# Altium project STM32_Digital_Audio.PrjPcb
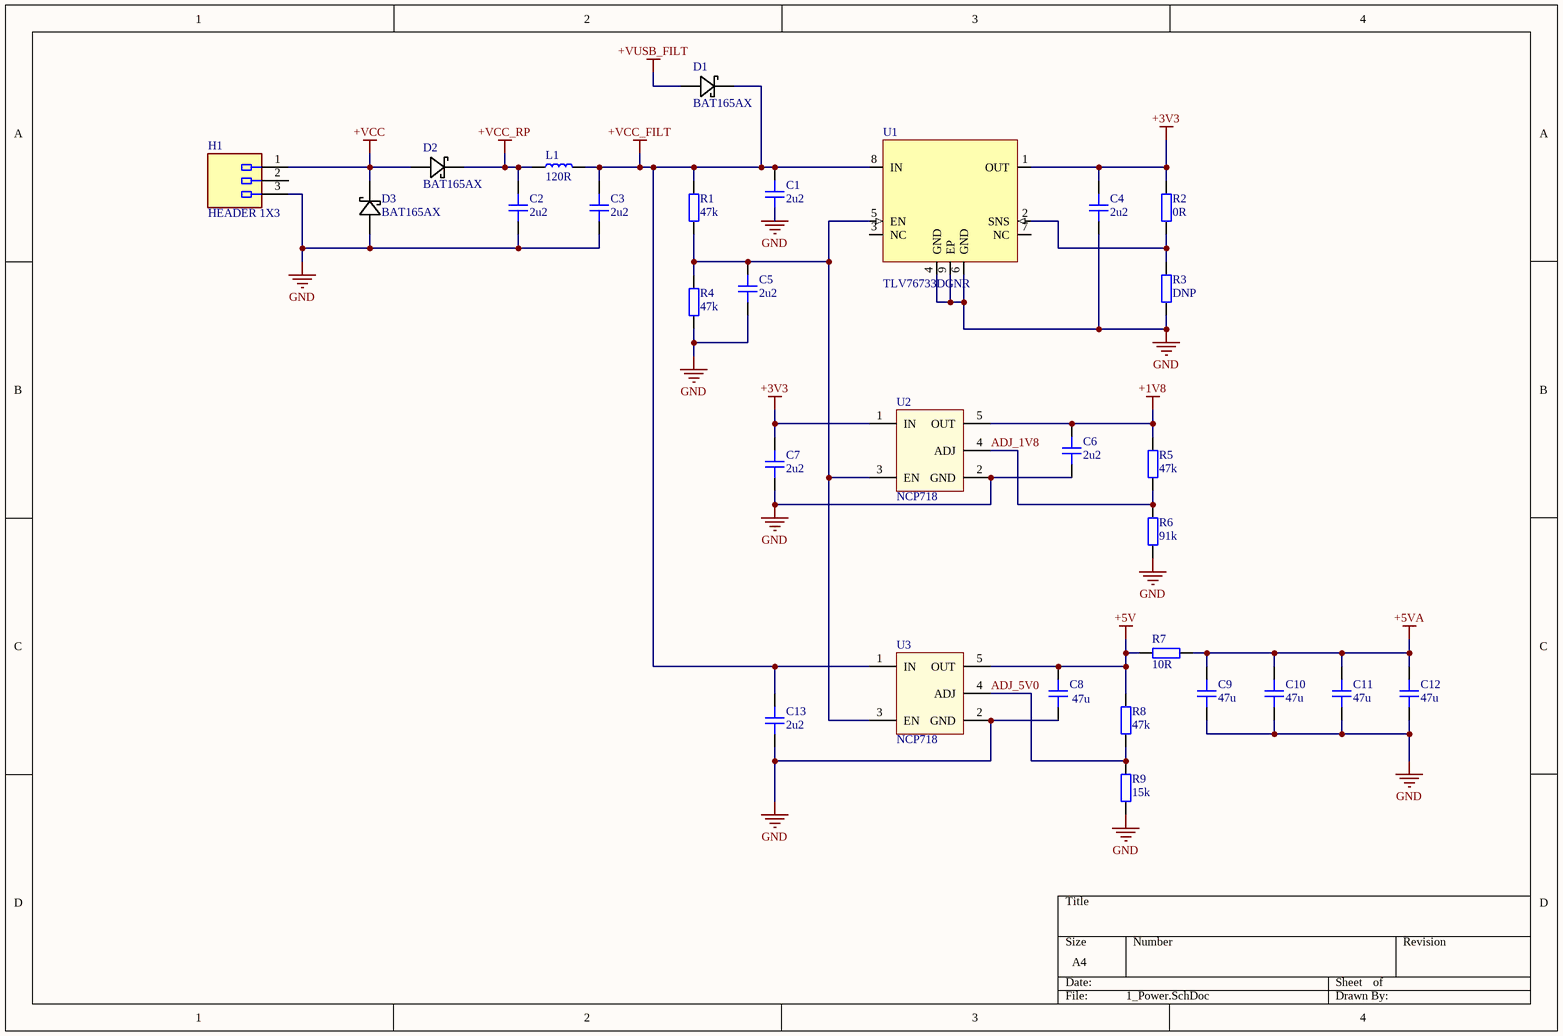
[diagram p0: 1_Power.SchDoc]
7 sheets, 218 parts. Net scope: global (net labels, ports and power ports of the same name join across sheets).
Board file: PCB.PcbDoc
Sheets:
  1_Power.SchDoc
  2_MCU.SchDoc
  3_Memory.SchDoc
  4_USB-HS.SchDoc
  5_Periperals.SchDoc
  6_CODEC.SchDoc
  7_Analogue.SchDoc

## Sheet 1_Power.SchDoc
size A4; SheetNumber: 1; SheetTotal: 7

### Parts
C1  2u2  [CAP_0201]
C2  2u2  [CAP_0201]
C3  2u2  [CAP_0201]
C4  2u2  [CAP_0201]
C5  2u2  [CAP_0201]
C6  2u2  [CAP_0201]
C7  2u2  [CAP_0201]
C8  47u  [CAP_0201]
C9  47u  [CAP_0201]
C10  47u  [CAP_0201]
C11  47u  [CAP_0201]
C12  47u  [CAP_0201]
C13  2u2  [CAP_0201]
D1  BAT165AX  [BAT165AX]
D2  BAT165AX  [BAT165AX]
D3  BAT165AX  [BAT165AX]
H1  HEADER 1X3  [053048-0310]
L1  120R  [IND_1008]
R1  47k  [RES_0402]
R2  0R  [RES_0805]
R3  DNP  [RES_0805]
R4  47k  [RES_0402]
R5  47k  [RES_0402]
R6  91k  [RES_0402]
R7  10R  [RES_0402]
R8  47k  [RES_0402]
R9  15k  [RES_0402]
U1  TLV76733DGNR  [HVSSOP-8]
U2  NCP718  [NCP718]
U3  NCP718  [NCP718]

### Nets
+1V8: C6.2 R5.2 U2.5(OUT)
+3V3: C4.2 C7.2 R2.2 U1.1(OUT) U2.1(IN)
+5V: C8.2 R7.2 R8.2 U3.5(OUT)
+5VA: C9.2 C10.2 C11.2 C12.2 R7.1
+VCC: D2.2 D3.1 H1.1
+VCC_FILT: C1.2 C3.2 C13.2 D1.1 L1.2 R1.2 U1.8(IN) U3.1(IN)
+VCC_RP: C2.2 D2.1 L1.1
+VUSB_FILT: D1.2
GND: C1.1 C2.1 C3.1 C4.1 C5.1 C6.1 C7.1 C8.1 C9.1 C10.1 C11.1 C12.1 C13.1 D3.2 H1.3 R3.1 R4.1 R6.1 R9.1 U1.4(GND) U1.6(GND) U1.9(EP) U2.2(GND) U3.2(GND)
ADJ_1V8: R5.1 R6.2 U2.4(ADJ)
ADJ_5V0: R8.1 R9.2 U3.4(ADJ)
NetC5_2: C5.2 R1.1 R4.2 U1.5(EN) U2.3(EN) U3.3(EN)
NetR2_1: R2.1 R3.2 U1.2(SNS)

Not connected (* = marked no-connect by the designer): H1 2; U1 3(NC) 7(NC)

### Library data of the parts
C1-C13 = CAP_0201: Capacitor SMD 0201; Manufacturer: *; Manufacturer Part Number: *; Distributor Link: *; LCSC: *; Rating: *; Dielectric: *
H1 = 053048-0310
L1 = IND_1008: Inductor SMD 1008
R1 R4-R9 = RES_0402: Resistor SMD 0402; Manufacturer: *; Manufacturer Part Number: *; Distributor Link: *; LCSC: *
R2 R3 = RES_0805: Resistor SMD 0805; Manufacturer: *; Manufacturer Part Number: *; Distributor Link: *; LCSC: *
U1 = TLV76733DGNR: 1A 3V3 LDO Regulator HVSSOP-8; Manufacturer: Texas Instruments; Manufacturer Part Number: TLV76733DGNR; Distributor Link: https://www.mouser.de/ProductDetail/Texas-Instruments/TLV76733DGNR?qs=sGAEpiMZZMug9GoBKXZ751mAF56Mq1BpE6IEorDiG8zdSVWisnEjQA%3D%3D

## Sheet 2_MCU.SchDoc
size 420 x 297 mm; SheetNumber: 2; SheetTotal: 7
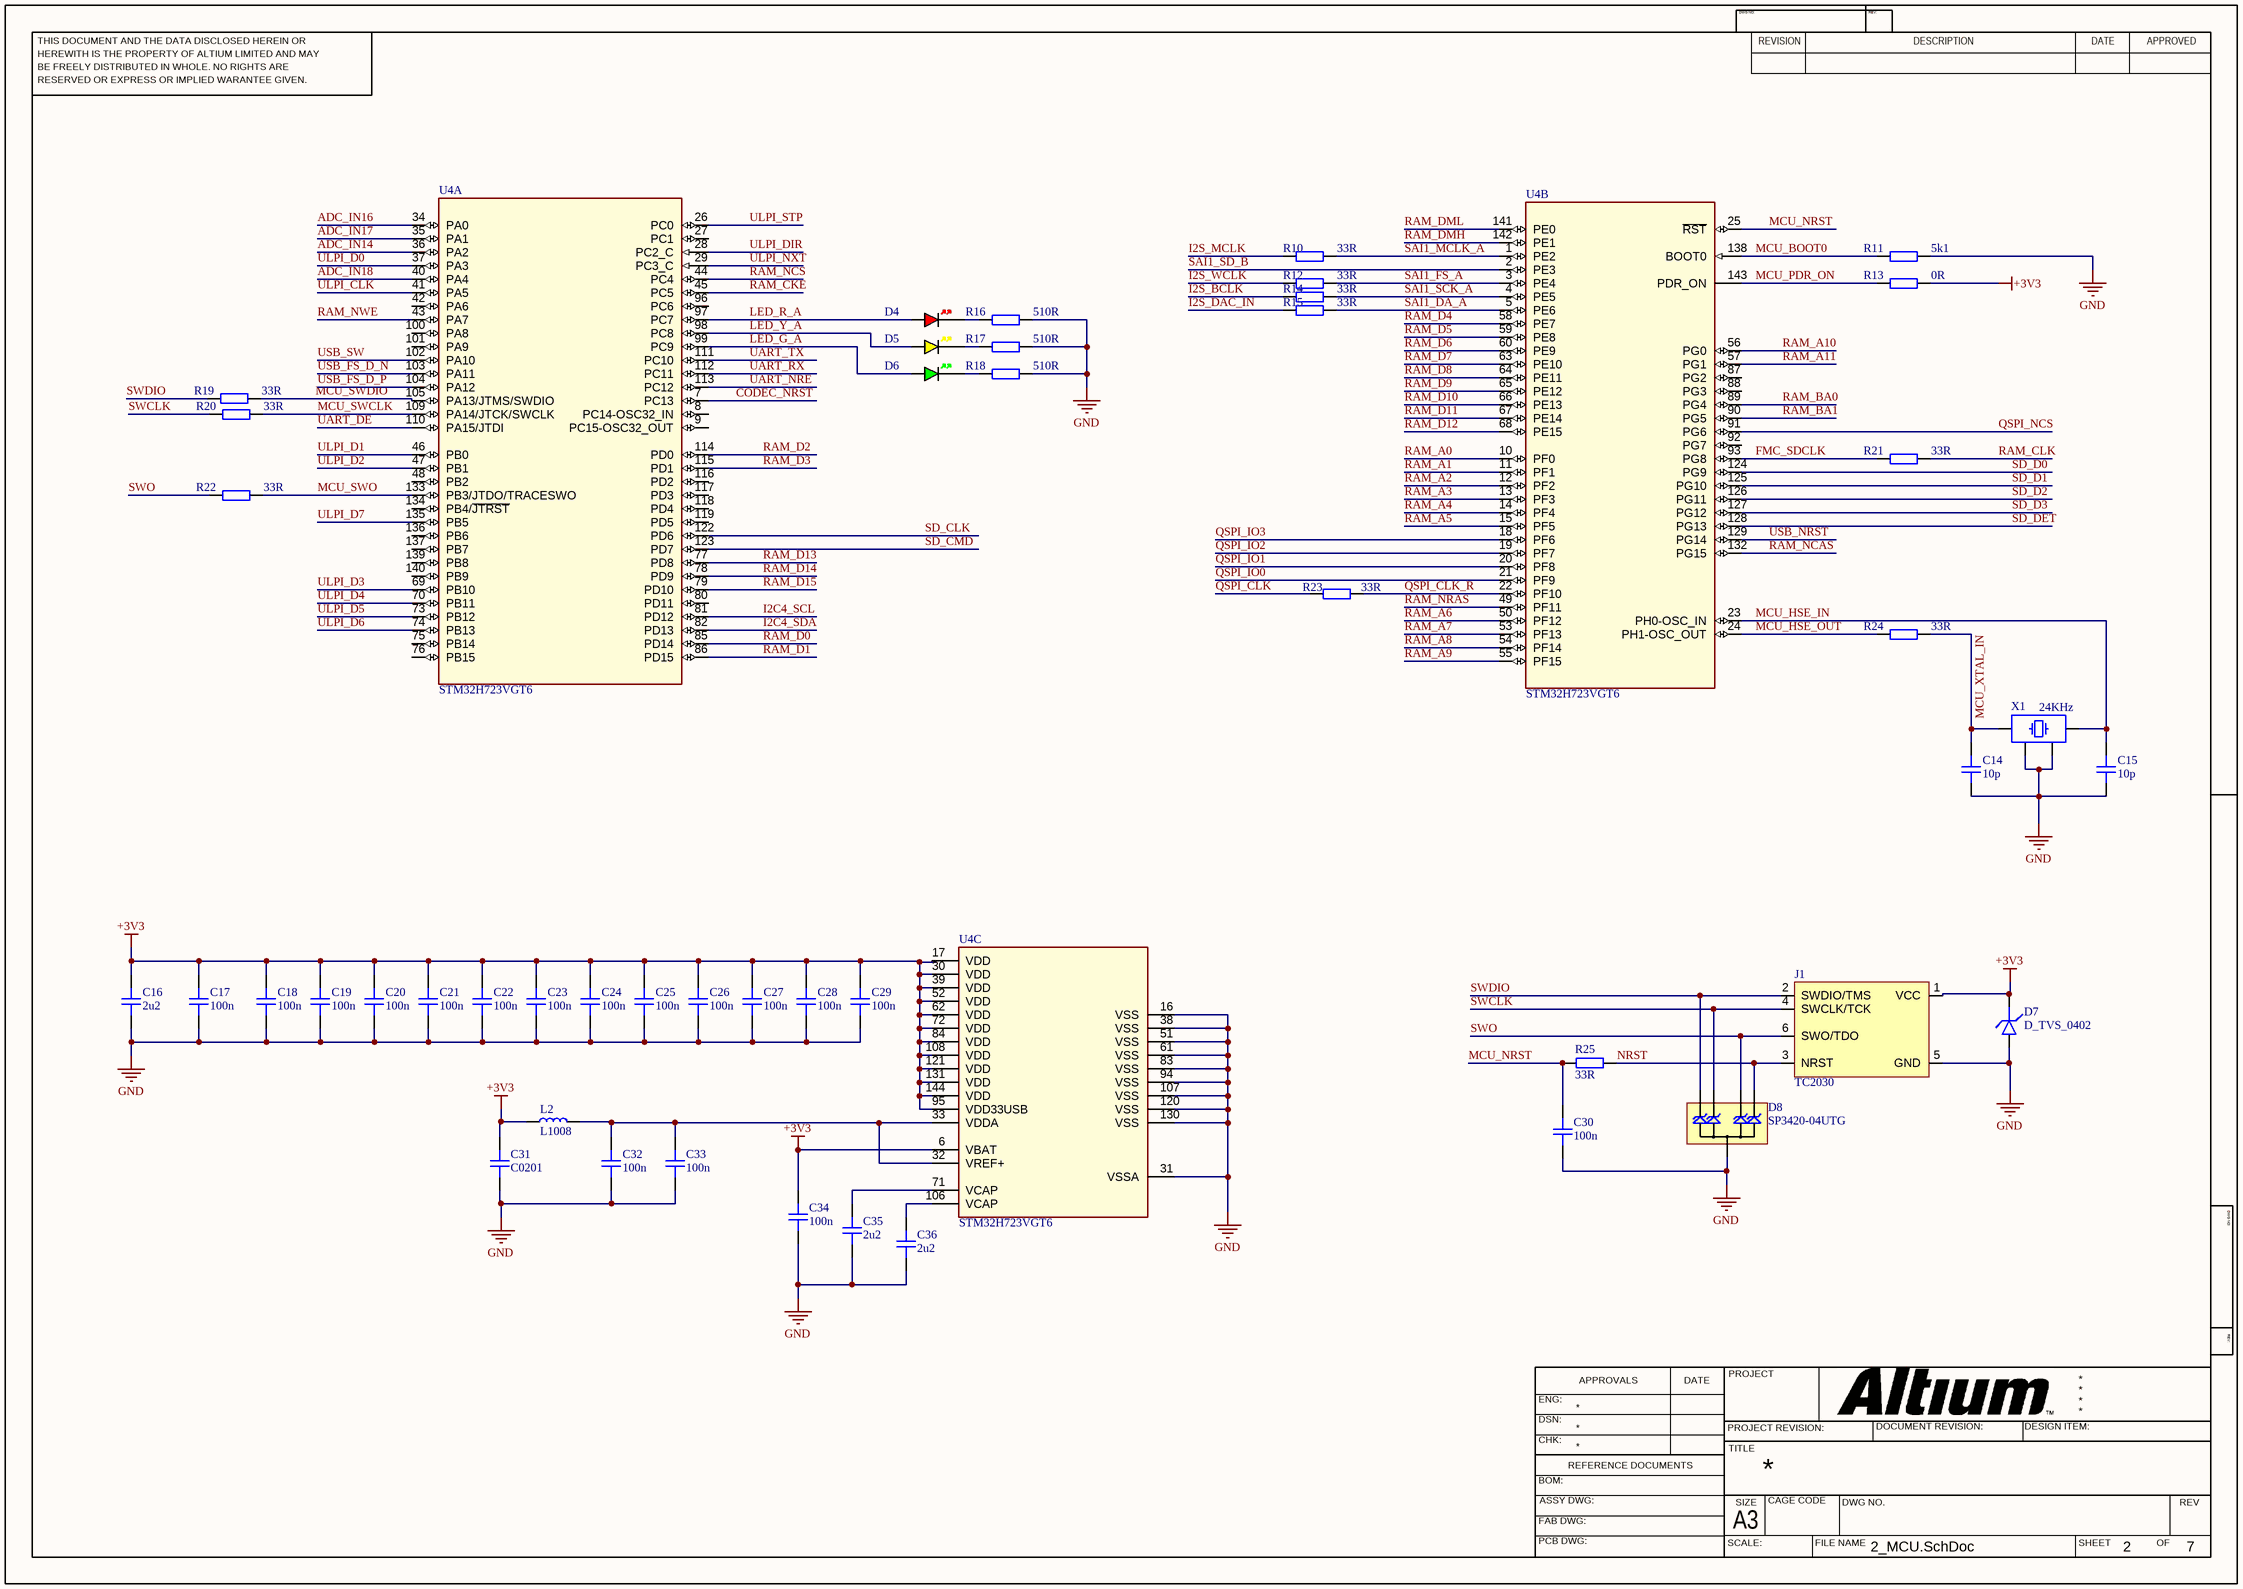
[diagram p1: 2_MCU.SchDoc]

### Parts
C14  10p  [CAP_0201]
C15  10p  [CAP_0201]
C16  2u2  [CAP_0201]
C17  100n  [CAP_0201]
C18  100n  [CAP_0201]
C19  100n  [CAP_0201]
C20  100n  [CAP_0201]
C21  100n  [CAP_0201]
C22  100n  [CAP_0201]
C23  100n  [CAP_0201]
C24  100n  [CAP_0201]
C25  100n  [CAP_0201]
C26  100n  [CAP_0201]
C27  100n  [CAP_0201]
C28  100n  [CAP_0201]
C29  100n  [CAP_0201]
C30  100n  [CAP_0201]
C31  C0201  [CAP_0201]
C32  100n  [CAP_0201]
C33  100n  [CAP_0201]
C34  100n  [CAP_0201]
C35  2u2  [CAP_0201]
C36  2u2  [CAP_0201]
D4  RED  [LED_0603_RED]  (value not drawn)
D5  YELLOW  [LED_0603_YELLOW]  (value not drawn)
D6  GREEN  [LED_0603_GREEN]  (value not drawn)
D7  D_TVS_0402  [D_0402]
D8  SP3420-04UTG  [uDFN-10]
J1  TC2030  [TC2030-FP]  (no BOM)
L2  L1008  [IND_1008]
R10  33R  [RES_0402]
R11  5k1  [RES_0402]
R12  33R  [RES_0402]
R13  0R  [RES_0402]
R14  33R  [RES_0402]
R15  33R  [RES_0402]
R16  510R  [RES_0402]
R17  510R  [RES_0402]
R18  510R  [RES_0402]
R19  33R  [RES_0402]
R20  33R  [RES_0402]
R21  33R  [RES_0402]
R22  33R  [RES_0402]
R23  33R  [RES_0402]
R24  33R  [RES_0402]
R25  33R  [RES_0402]
U4  STM32H723VGT6  [STM32H7]  (parts A,B,C of 3)
X1  24KHz  [XTAL_2520]

### Nets
+3V3: C16.2 C17.2 C18.2 C19.2 C20.2 C21.2 C22.2 C23.2 C24.2 C25.2 C26.2 C27.2 C28.2 C29.2 C31.2 C34.2 D7.K J1.1(VCC) L2.1 R13.2 U4.6(VBAT) U4.30(VDD) U4.39(VDD) U4.52(VDD) U4.62(VDD) U4.72(VDD) U4.84(VDD) U4.95(VDD33USB) U4.108(VDD) U4.121(VDD) U4.131(VDD) U4.144(VDD)
GND: C14.1 C15.1 C16.1 C17.1 C18.1 C19.1 C20.1 C21.1 C22.1 C23.1 C24.1 C25.1 C26.1 C27.1 C28.1 C29.1 C30.1 C31.1 C32.1 C33.1 C34.1 C35.1 C36.1 D7.A D8.38(GND) J1.5(GND) R11.2 R16.2 R17.2 R18.2 U4.16(VSS) U4.31(VSSA) U4.38(VSS) U4.51(VSS) U4.61(VSS) U4.83(VSS) U4.94(VSS) U4.107(VSS) U4.120(VSS) U4.130(VSS) X1.2 X1.4
ADC_IN14: U4.36(PA2)
ADC_IN16: U4.34(PA0)
ADC_IN17: U4.35(PA1)
ADC_IN18: U4.40(PA4)
CODEC_NRST: U4.7(PC13)
FMC_SDCLK: R21.1 U4.93(PG8)
I2C4_SCL: U4.81(PD12)
I2C4_SDA: U4.82(PD13)
I2S_BCLK: R14.1
I2S_DAC_IN: R15.1
I2S_MCLK: R10.1
I2S_WCLK: R12.1
LED_G_A: D6.A U4.99(PC9)
LED_R_A: D4.A U4.97(PC7)
LED_Y_A: D5.A U4.98(PC8)
MCU_BOOT0: R11.1 U4.138(BOOT0)
MCU_HSE_IN: C15.2 U4.23(PH0-OSC_IN) X1.3
MCU_HSE_OUT: R24.1 U4.24(PH1-OSC_OUT)
MCU_NRST: C30.2 R25.1 U4.25(~{RST})
MCU_PDR_ON: R13.1 U4.143(PDR_ON)
MCU_SWCLK: R20.2 U4.109(PA14/JTCK/SWCLK)
MCU_SWDIO: R19.2 U4.105(PA13/JTMS/SWDIO)
MCU_SWO: R22.2 U4.133(PB3/JTDO/TRACESWO)
MCU_XTAL_IN: C14.2 R24.2 X1.1
NRST: D8.56 J1.3(NRST) R25.2
QSPI_CLK: R23.1
QSPI_CLK_R: R23.2 U4.22(PF10)
QSPI_IO0: U4.21(PF9)
QSPI_IO1: U4.20(PF8)
QSPI_IO2: U4.19(PF7)
QSPI_IO3: U4.18(PF6)
QSPI_NCS: U4.91(PG6)
RAM_A0: U4.10(PF0)
RAM_A1: U4.11(PF1)
RAM_A2: U4.12(PF2)
RAM_A3: U4.13(PF3)
RAM_A4: U4.14(PF4)
RAM_A5: U4.15(PF5)
RAM_A6: U4.50(PF12)
RAM_A7: U4.53(PF13)
RAM_A8: U4.54(PF14)
RAM_A9: U4.55(PF15)
RAM_A10: U4.56(PG0)
RAM_A11: U4.57(PG1)
RAM_BA0: U4.89(PG4)
RAM_BA1: U4.90(PG5)
RAM_CKE: U4.45(PC5)
RAM_CLK: R21.2
RAM_D0: U4.85(PD14)
RAM_D1: U4.86(PD15)
RAM_D2: U4.114(PD0)
RAM_D3: U4.115(PD1)
RAM_D4: U4.58(PE7)
RAM_D5: U4.59(PE8)
RAM_D6: U4.60(PE9)
RAM_D7: U4.63(PE10)
RAM_D8: U4.64(PE11)
RAM_D9: U4.65(PE12)
RAM_D10: U4.66(PE13)
RAM_D11: U4.67(PE14)
RAM_D12: U4.68(PE15)
RAM_D13: U4.77(PD8)
RAM_D14: U4.78(PD9)
RAM_D15: U4.79(PD10)
RAM_DMH: U4.142(PE1)
RAM_DML: U4.141(PE0)
RAM_NCAS: U4.132(PG15)
RAM_NCS: U4.44(PC4)
RAM_NRAS: U4.49(PF11)
RAM_NWE: U4.43(PA7)
SAI1_DA_A: R15.2 U4.5(PE6)
SAI1_FS_A: R12.2 U4.3(PE4)
SAI1_MCLK_A: R10.2 U4.1(PE2)
SAI1_SCK_A: R14.2 U4.4(PE5)
SAI1_SD_B: U4.2(PE3)
SD_CLK: U4.122(PD6)
SD_CMD: U4.123(PD7)
SD_D0: U4.124(PG9)
SD_D1: U4.125(PG10)
SD_D2: U4.126(PG11)
SD_D3: U4.127(PG12)
SD_DET: U4.128(PG13)
SWCLK: D8.29 J1.4(SWCLK/TCK) R20.1
SWDIO: D8.110 J1.2(SWDIO/TMS) R19.1
SWO: D8.47 J1.6(SWO/TDO) R22.1
UART_DE: U4.110(PA15/JTDI)
UART_NRE: U4.113(PC12)
UART_RX: U4.112(PC11)
UART_TX: U4.111(PC10)
ULPI_CLK: U4.41(PA5)
ULPI_D0: U4.37(PA3)
ULPI_D1: U4.46(PB0)
ULPI_D2: U4.47(PB1)
ULPI_D3: U4.69(PB10)
ULPI_D4: U4.70(PB11)
ULPI_D5: U4.73(PB12)
ULPI_D6: U4.74(PB13)
ULPI_D7: U4.135(PB5)
ULPI_DIR: U4.28(PC2_C)
ULPI_NXT: U4.29(PC3_C)
ULPI_STP: U4.26(PC0)
USB_FS_D_N: U4.103(PA11)
USB_FS_D_P: U4.104(PA12)
USB_NRST: U4.129(PG14)
USB_SW: U4.102(PA10)
NetC32_2: C32.2 C33.2 L2.2 U4.32(VREF+) U4.33(VDDA)
NetC35_2: C35.2 U4.71(VCAP)
NetC36_2: C36.2 U4.106(VCAP)
NetD4_K: D4.K R16.1
NetD5_K: D5.K R17.1
NetD6_K: D6.K R18.1

Not connected (* = marked no-connect by the designer): U4 8(PC14-OSC32_IN) 9(PC15-OSC32_OUT) 17(VDD) 27(PC1) 42(PA6) 48(PB2) 75(PB14) 76(PB15) 80(PD11) 87(PG2) 88(PG3) 92(PG7) 96(PC6) 100(PA8) 101(PA9) 116(PD2) 117(PD3) 118(PD4) 119(PD5) 134(PB4/~{JTRST}) 136(PB6) 137(PB7) 139(PB8) 140(PB9)

### Notes on the sheet
- THIS DOCUMENT AND THE DATA DISCLOSED HEREIN OR
- HEREWITH IS THE PROPERTY OF ALTIUM LIMITED AND MAY
- DWG NO:
- REVISION
- REV:
- DESCRIPTION
- DATE
- APPROVED
- BE FREELY DISTRIBUTED IN WHOLE. NO RIGHTS ARE
- RESERVED OR EXPRESS OR IMPLIED WARANTEE GIVEN.
- ENG:
- APPROVALS
- PROJECT
- DSN:
- CHK:
- REFERENCE DOCUMENTS
- PROJECT REVISION:
- TITLE
- DOCUMENT REVISION:
- DESIGN ITEM:
- BOM:
- FAB DWG:
- PCB DWG:
- ASSY DWG:
- SCALE:
- A3
- SIZE
- CAGE CODE
- FILE NAME
- DWG NO.
- SHEET
- OF
- REV

### Library data of the parts
C14-C36 = CAP_0201: Capacitor SMD 0201; Manufacturer: *; Manufacturer Part Number: *; Distributor Link: *; LCSC: *; Rating: *; Dielectric: *
D4 = LED_0603_RED: LED 0603 RED SMD
D5 = LED_0603_YELLOW: LED 0603 YELLOW SMD
D6 = LED_0603_GREEN: LED 0603 GREEN SMD
D7 = D_TVS_0402: Diode TVS / ESD 0402
D8 = SP3420-04UTG: TVS Diode Array Low Capacitance ESD Protection 4-Channel (Vwork=3V3, Vclamp=6V); Manufacturer: Littelfuse; Manufacturer Part Number: SP3420-04UTG
J1 = TC2030: Tag-Connect No-Solder SWD Debug Connector DO NOT PLACE; Manufacturer: Tag-Connect; Manufacturer Part Number: TC2030
L2 = IND_1008: Inductor SMD 1008
R10-R25 = RES_0402: Resistor SMD 0402; Manufacturer: *; Manufacturer Part Number: *; Distributor Link: *; LCSC: *
X1 = XTAL_2520: Crystal SMD 2520; Distributor Link: *

## Sheet 3_Memory.SchDoc
size A4; SheetNumber: 3; SheetTotal: 7
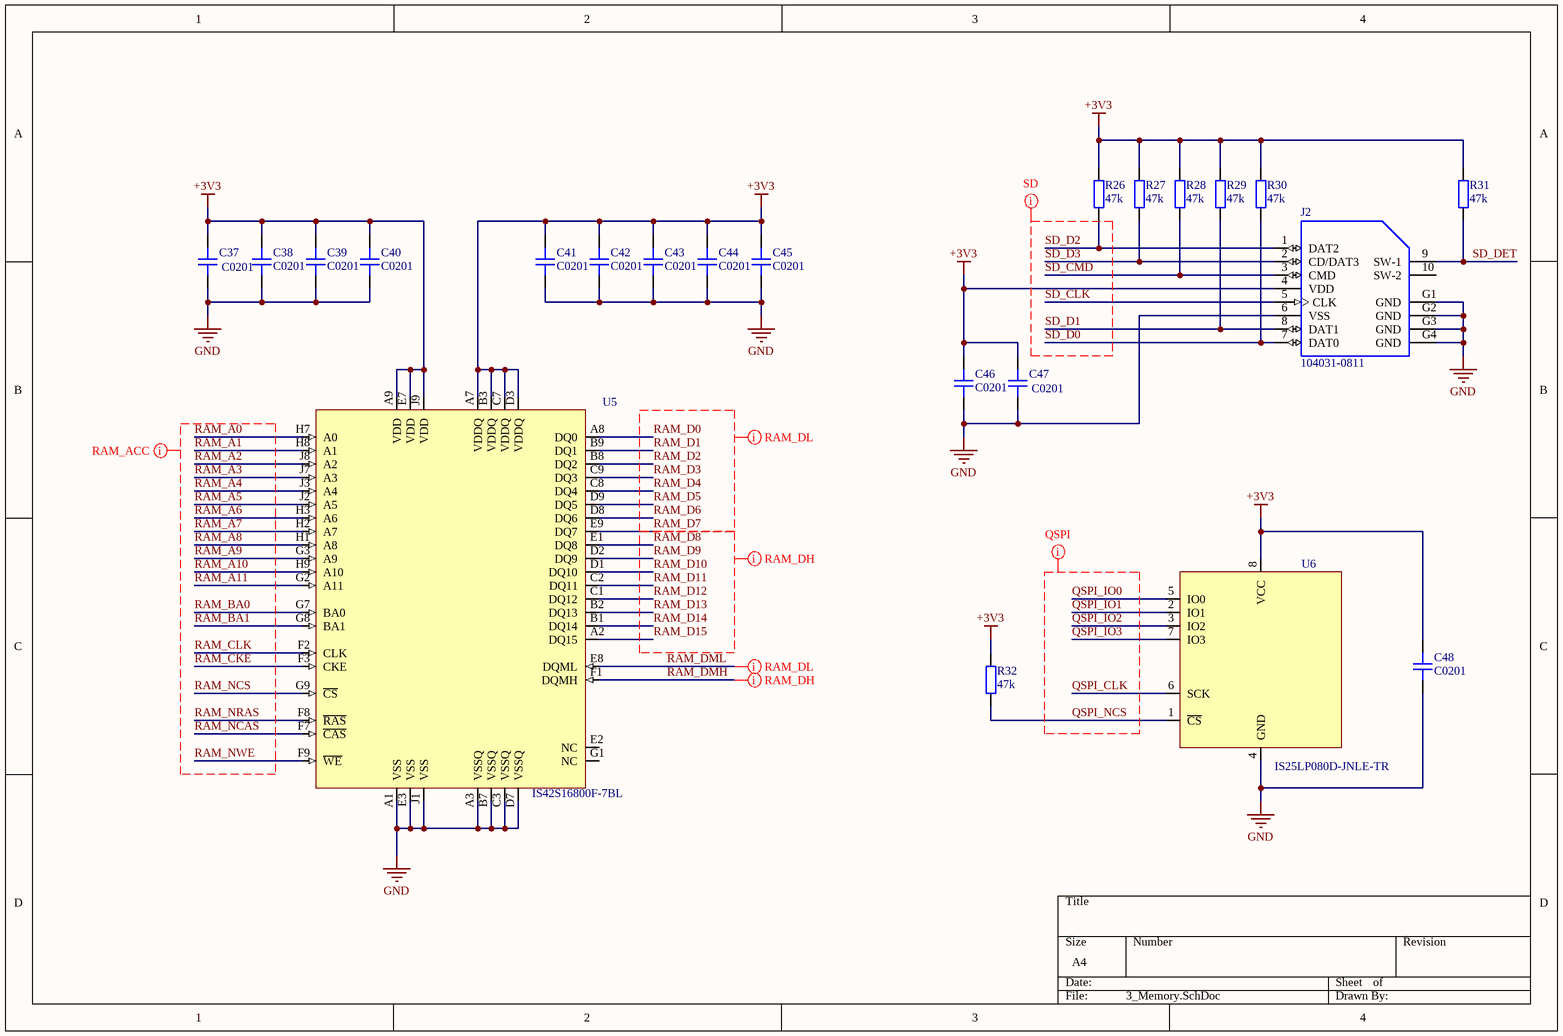
[diagram p2: 3_Memory.SchDoc]

### Parts
C37  C0201  [CAP_0201]
C38  C0201  [CAP_0201]
C39  C0201  [CAP_0201]
C40  C0201  [CAP_0201]
C41  C0201  [CAP_0201]
C42  C0201  [CAP_0201]
C43  C0201  [CAP_0201]
C44  C0201  [CAP_0201]
C45  C0201  [CAP_0201]
C46  C0201  [CAP_0201]
C47  C0201  [CAP_0201]
C48  C0201  [CAP_0201]
J2  104031-0811  [104031-0811]
R26  47k  [RES_0402]
R27  47k  [RES_0402]
R28  47k  [RES_0402]
R29  47k  [RES_0402]
R30  47k  [RES_0402]
R31  47k  [RES_0402]
R32  47k  [RES_0402]
U5  IS42S16800F-7BL  [BGA54C80P9X9_800X800X120]
U6  IS25LP080D-JNLE-TR  [SOIC-8]

### Nets
+3V3: C37.2 C38.2 C39.2 C40.2 C41.2 C42.2 C43.2 C44.2 C45.2 C46.2 C47.2 C48.2 J2.4(VDD) R26.2 R27.2 R28.2 R29.2 R30.2 R31.2 R32.2 U5.A7(VDDQ) U5.A9(VDD) U5.B3(VDDQ) U5.C7(VDDQ) U5.D3(VDDQ) U5.E7(VDD) U5.J9(VDD) U6.8(VCC)
GND: C37.1 C38.1 C39.1 C40.1 C41.1 C42.1 C43.1 C44.1 C45.1 C46.1 C47.1 C48.1 J2.6(VSS) J2.G1(GND) J2.G2(GND) J2.G3(GND) J2.G4(GND) U5.A1(VSS) U5.A3(VSSQ) U5.B7(VSSQ) U5.C3(VSSQ) U5.D7(VSSQ) U5.E3(VSS) U5.J1(VSS) U6.4(GND)
QSPI_CLK: U6.6(SCK)
QSPI_IO0: U6.5(IO0)
QSPI_IO1: U6.2(IO1)
QSPI_IO2: U6.3(IO2)
QSPI_IO3: U6.7(IO3)
QSPI_NCS: R32.1 U6.1(~{CS})
RAM_A0: U5.H7(A0)
RAM_A1: U5.H8(A1)
RAM_A2: U5.J8(A2)
RAM_A3: U5.J7(A3)
RAM_A4: U5.J3(A4)
RAM_A5: U5.J2(A5)
RAM_A6: U5.H3(A6)
RAM_A7: U5.H2(A7)
RAM_A8: U5.H1(A8)
RAM_A9: U5.G3(A9)
RAM_A10: U5.H9(A10)
RAM_A11: U5.G2(A11)
RAM_BA0: U5.G7(BA0)
RAM_BA1: U5.G8(BA1)
RAM_CKE: U5.F3(CKE)
RAM_CLK: U5.F2(CLK)
RAM_D0: U5.A8(DQ0)
RAM_D1: U5.B9(DQ1)
RAM_D2: U5.B8(DQ2)
RAM_D3: U5.C9(DQ3)
RAM_D4: U5.C8(DQ4)
RAM_D5: U5.D9(DQ5)
RAM_D6: U5.D8(DQ6)
RAM_D7: U5.E9(DQ7)
RAM_D8: U5.E1(DQ8)
RAM_D9: U5.D2(DQ9)
RAM_D10: U5.D1(DQ10)
RAM_D11: U5.C2(DQ11)
RAM_D12: U5.C1(DQ12)
RAM_D13: U5.B2(DQ13)
RAM_D14: U5.B1(DQ14)
RAM_D15: U5.A2(DQ15)
RAM_DMH: U5.F1(DQMH)
RAM_DML: U5.E8(DQML)
RAM_NCAS: U5.F7(~{CAS})
RAM_NCS: U5.G9(~{CS})
RAM_NRAS: U5.F8(~{RAS})
RAM_NWE: U5.F9(~{WE})
SD_CLK: J2.5(CLK)
SD_CMD: J2.3(CMD) R28.1
SD_D0: J2.7(DAT0) R30.1
SD_D1: J2.8(DAT1) R29.1
SD_D2: J2.1(DAT2) R26.1
SD_D3: J2.2(CD/DAT3) R27.1
SD_DET: J2.9(SW-1) R31.1

Not connected (* = marked no-connect by the designer): J2 10(SW-2); U5 E2(NC) G1(NC)

### Layout directives
net class RAM_DL: RAM_D0, RAM_D1, RAM_D2, RAM_D3, RAM_D4, RAM_D5, RAM_D6, RAM_D7, RAM_DML
net class RAM_DH: RAM_D7, RAM_D8, RAM_D9, RAM_D10, RAM_D11, RAM_D12, RAM_D13, RAM_D14, RAM_D15, RAM_DMH
net class RAM_ACC: RAM_A0, RAM_A1, RAM_A2, RAM_A3, RAM_A4, RAM_A5, RAM_A6, RAM_A7, RAM_A8, RAM_A9, RAM_A10, RAM_A11, RAM_BA0, RAM_BA1, RAM_CKE, RAM_CLK, RAM_NCAS, RAM_NCS, RAM_NRAS, RAM_NWE
net class QSPI: QSPI_CLK, QSPI_IO0, QSPI_IO1, QSPI_IO2, QSPI_IO3, QSPI_NCS
net class SD: SD_CLK, SD_CMD, SD_D0, SD_D1, SD_D2, SD_D3

### Library data of the parts
C37-C48 = CAP_0201: Capacitor SMD 0201; Manufacturer: *; Manufacturer Part Number: *; Distributor Link: *; LCSC: *; Rating: *; Dielectric: *
R26-R32 = RES_0402: Resistor SMD 0402; Manufacturer: *; Manufacturer Part Number: *; Distributor Link: *; LCSC: *
U5 = IS42S16800F-*B: SDRAM 128Mbit 8Mx16 143Mhz 3.3V 54-ball BGA; Manufacturer: ISSI; Manufacturer Part Number: IS42S16800F-*B*
U6 = IS25LP080D-JNLE-TR: QSPI NOR Flash Memory 8 Mbit SOIC-8; Manufacturer: ISSI; Manufacturer Part Number: IS25LP080D-JNLE-TR

## Sheet 4_USB-HS.SchDoc
size A4; SheetNumber: 4; SheetTotal: 7
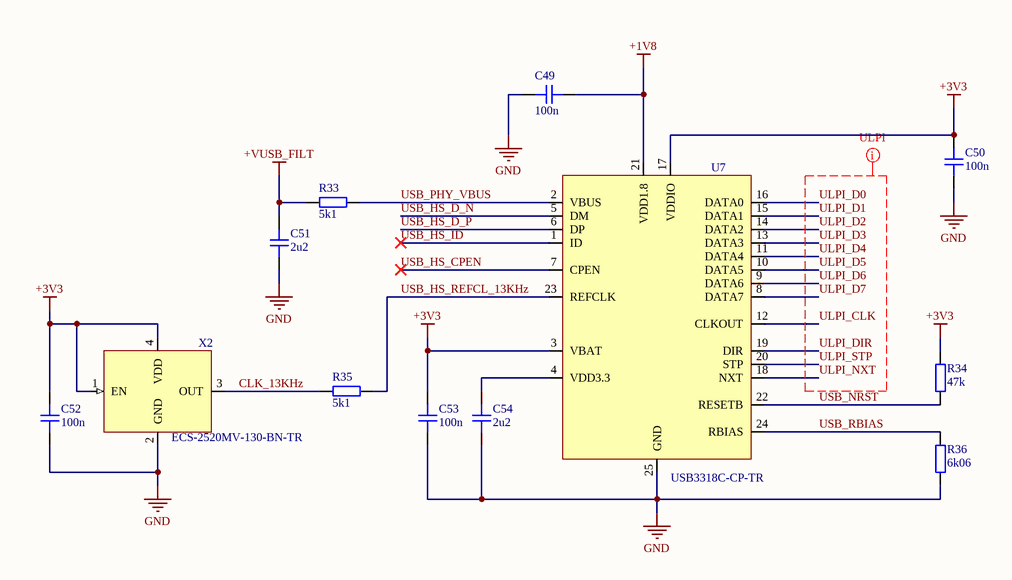
[diagram p3: 4_USB-HS.SchDoc]

### Parts
C49  100n  [CAP_0201]
C50  100n  [CAP_0201]
C51  2u2  [CAP_0201]
C52  100n  [CAP_0201]
C53  100n  [CAP_0201]
C54  2u2  [CAP_0201]
R33  5k1  [RES_0402]
R34  47k  [RES_0402]
R35  5k1  [RES_0402]
R36  6k06  [RES_0402]
U7  USB3318C-CP-TR  [USB3318C-CP-TR]
X2  ECS-2520MV-130-BN-TR  [XTAL_2520]

### Nets
+1V8: C49.2 U7.21(VDD1.8)
+3V3: C50.2 C52.2 C53.2 R34.2 U7.3(VBAT) U7.17(VDDIO) X2.1(EN) X2.4(VDD)
+VUSB_FILT: C51.2 R33.2
GND: C49.1 C50.1 C51.1 C52.1 C53.1 C54.1 R36.1 U7.25(GND) X2.2(GND)
CLK_13KHz: R35.2 X2.3(OUT)
ULPI_CLK: U7.12(CLKOUT)
ULPI_D0: U7.16(DATA0)
ULPI_D1: U7.15(DATA1)
ULPI_D2: U7.14(DATA2)
ULPI_D3: U7.13(DATA3)
ULPI_D4: U7.11(DATA4)
ULPI_D5: U7.10(DATA5)
ULPI_D6: U7.9(DATA6)
ULPI_D7: U7.8(DATA7)
ULPI_DIR: U7.19(DIR)
ULPI_NXT: U7.18(NXT)
ULPI_STP: U7.20(STP)
USB_HS_CPEN: U7.7(CPEN)
USB_HS_D_N: U7.5(DM)
USB_HS_D_P: U7.6(DP)
USB_HS_ID: U7.1(ID)
USB_HS_REFCL_13KHz: R35.1 U7.23(REFCLK)
USB_NRST: R34.1 U7.22(RESETB)
USB_PHY_VBUS: R33.1 U7.2(VBUS)
USB_RBIAS: R36.2 U7.24(RBIAS)
NetC54_2: C54.2 U7.4(VDD3.3)

### Layout directives
net class ULPI: ULPI_CLK, ULPI_D0, ULPI_D1, ULPI_D2, ULPI_D3, ULPI_D4, ULPI_D5, ULPI_D6, ULPI_D7, ULPI_DIR, ULPI_NXT, ULPI_STP

### Library data of the parts
C49-C54 = CAP_0201: Capacitor SMD 0201; Manufacturer: *; Manufacturer Part Number: *; Distributor Link: *; LCSC: *; Rating: *; Dielectric: *
R33-R36 = RES_0402: Resistor SMD 0402; Manufacturer: *; Manufacturer Part Number: *; Distributor Link: *; LCSC: *
U7 = USB3318C-CP-TR: USB Interface IC High Speed USB 1.8V ULPI; Manufacturer: Microchip; Manufacturer Part Number: USB3318C-CP-TR
X2 = ECS-2520MV-130-BN-TR: Standard Clock Oscillators XO (Standard),13MHz,Standby (Power Down),CMOS, Multi-Volt,1.6 V 3.6 V,+/-50ppm,-40 C 85 C,6mA,Surface Mount,4-SMD, No Lead,(2.50mm x 2.00mm),(0.80mm); Manufacturer: ECS; Manufacturer Part Number: ECS-2520MV-130-BN-TR

## Sheet 5_Periperals.SchDoc
size A4; SheetNumber: 5; SheetTotal: 7
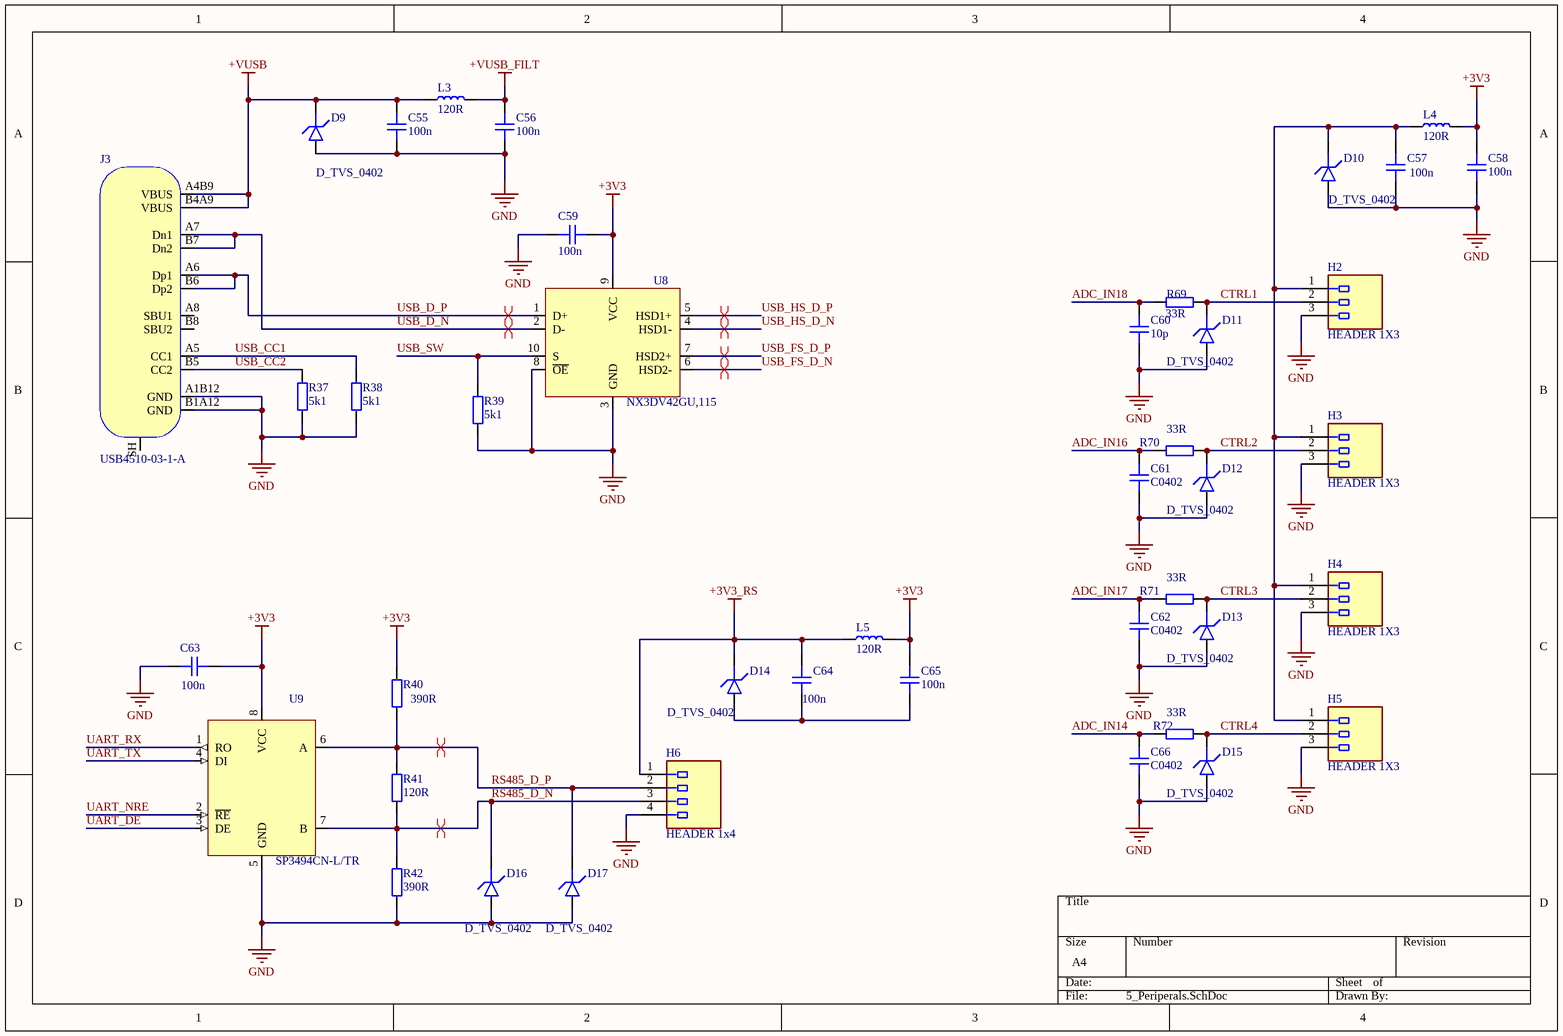
[diagram p4: 5_Periperals.SchDoc]

### Parts
C55  100n  [CAP_0402]
C56  100n  [CAP_0402]
C57  100n  [CAP_0402]
C58  100n  [CAP_0402]
C59  100n  [CAP_0402]
C60  10p  [CAP_0402]
C61  C0402  [CAP_0402]
C62  C0402  [CAP_0402]
C63  100n  [CAP_0402]
C64  100n  [CAP_0402]
C65  100n  [CAP_0402]
C66  C0402  [CAP_0402]
D9  D_TVS_0402  [D_0402]
D10  D_TVS_0402  [D_0402]
D11  D_TVS_0402  [D_0402]
D12  D_TVS_0402  [D_0402]
D13  D_TVS_0402  [D_0402]
D14  D_TVS_0402  [D_0402]
D15  D_TVS_0402  [D_0402]
D16  D_TVS_0402  [D_0402]
D17  D_TVS_0402  [D_0402]
H2  HEADER 1X3  [053048-0310]
H3  HEADER 1X3  [053048-0310]
H4  HEADER 1X3  [053048-0310]
H5  HEADER 1X3  [053048-0310]
H6  HEADER 1x4  [053048-0410]
J3  USB4510-03-1-A  [USB4510-03-1-A]
L3  120R  [IND_0402]
L4  120R  [IND_0402]
L5  120R  [IND_0402]
R37  5k1  [RES_0402]
R38  5k1  [RES_0402]
R39  5k1  [RES_0402]
R40  390R  [RES_0402]
R41  120R  [RES_0402]
R42  390R  [RES_0402]
R69  33R  [RES_0402]
R70  33R  [RES_0402]
R71  33R  [RES_0402]
R72  33R  [RES_0402]
U8  NX3DV42GU,115  [XQFN-10_SOT1160-1]
U9  SP3494CN-L/TR  [SOIC-8]

### Nets
+3V3: C58.1 C59.1 C63.2 C65.1 L4.2 L5.2 R40.2 U8.9(VCC) U9.8(VCC)
+3V3_RS: C64.1 D14.K H6.1 L5.1
+VUSB: C55.1 D9.K J3.A4B9(VBUS) J3.B4A9(VBUS) L3.1
+VUSB_FILT: C56.1 L3.2
GND: C55.2 C56.2 C57.2 C58.2 C59.2 C60.2 C61.2 C62.2 C63.1 C66.2 D9.A D10.A D11.A D12.A D13.A D15.A D16.A D17.A H2.3 H3.3 H4.3 H5.3 H6.4 J3.A1B12(GND) J3.B1A12(GND) R37.1 R38.1 R39.1 R42.1 U8.3(GND) U8.8(~{OE}) U9.5(GND)
ADC_IN14: C66.1 R72.1
ADC_IN16: C61.1 R70.1
ADC_IN17: C62.1 R71.1
ADC_IN18: C60.1 R69.1
CTRL1: D11.K H2.2 R69.2
CTRL2: D12.K H3.2 R70.2
CTRL3: D13.K H4.2 R71.2
CTRL4: D15.K H5.2 R72.2
RS485_D_N: D16.K H6.3 R41.1 R42.2 U9.7(B)
RS485_D_P: D17.K H6.2 R40.1 R41.2 U9.6(A)
UART_DE: U9.3(DE)
UART_NRE: U9.2(~{RE})
UART_RX: U9.1(RO)
UART_TX: U9.4(DI)
USB_CC1: J3.A5(CC1) R38.2
USB_CC2: J3.B5(CC2) R37.2
USB_D_N: J3.A7(Dn1) J3.B7(Dn2) U8.2(D-)
USB_D_P: J3.A6(Dp1) J3.B6(Dp2) U8.1(D+)
USB_FS_D_N: U8.6(HSD2-)
USB_FS_D_P: U8.7(HSD2+)
USB_HS_D_N: U8.4(HSD1-)
USB_HS_D_P: U8.5(HSD1+)
USB_SW: R39.2 U8.10(S)
NetC57_1: C57.1 D10.K H2.1 H3.1 H4.1 H5.1 L4.1
NetC64_2: C64.2 C65.2 D14.A

Not connected (* = marked no-connect by the designer): J3 A8(SBU1) B8(SBU2) SH(SHIELD)

### Layout directives
differential pair: RS485_D_N, RS485_D_P, USB_D_N, USB_D_P, USB_FS_D_N, USB_FS_D_P, USB_HS_D_N, USB_HS_D_P

### Library data of the parts
C55-C66 = CAP_0402: Capacitor SMD 0402; Manufacturer: *; Manufacturer Part Number: *; Distributor Link: *; LCSC: *; Rating: *; Dielectric: *
D9-D17 = D_TVS_0402: Diode TVS / ESD 0402
H2-H5 = 053048-0310
H6 = 053048-0410
J3 = USB4510-03-1-A: USB Connector Type C SMT Mid-Mount 16 Pin; Manufacturer: GCT; Manufacturer Part Number: USB4510-03-1-A
L3-L5 = IND_0402: Inductor SMD 0402
R37-R42 R69-R72 = RES_0402: Resistor SMD 0402; Manufacturer: *; Manufacturer Part Number: *; Distributor Link: *; LCSC: *
U8 = NX3DV42GU,115: USB2.0 HS DPDT Switch; Manufacturer: NXP Semiconductors; Manufacturer Part Number: NX3DV42GU,115
U9 = SP3494CN-L/TR: 3.3V Low Power RS-485 / RS-422 Transceiver SOIC-8; Manufacturer: MaxLinear; Manufacturer Part Number: SP3494CN-L/TR

## Sheet 6_CODEC.SchDoc
size A4; SheetNumber: 6; SheetTotal: 7
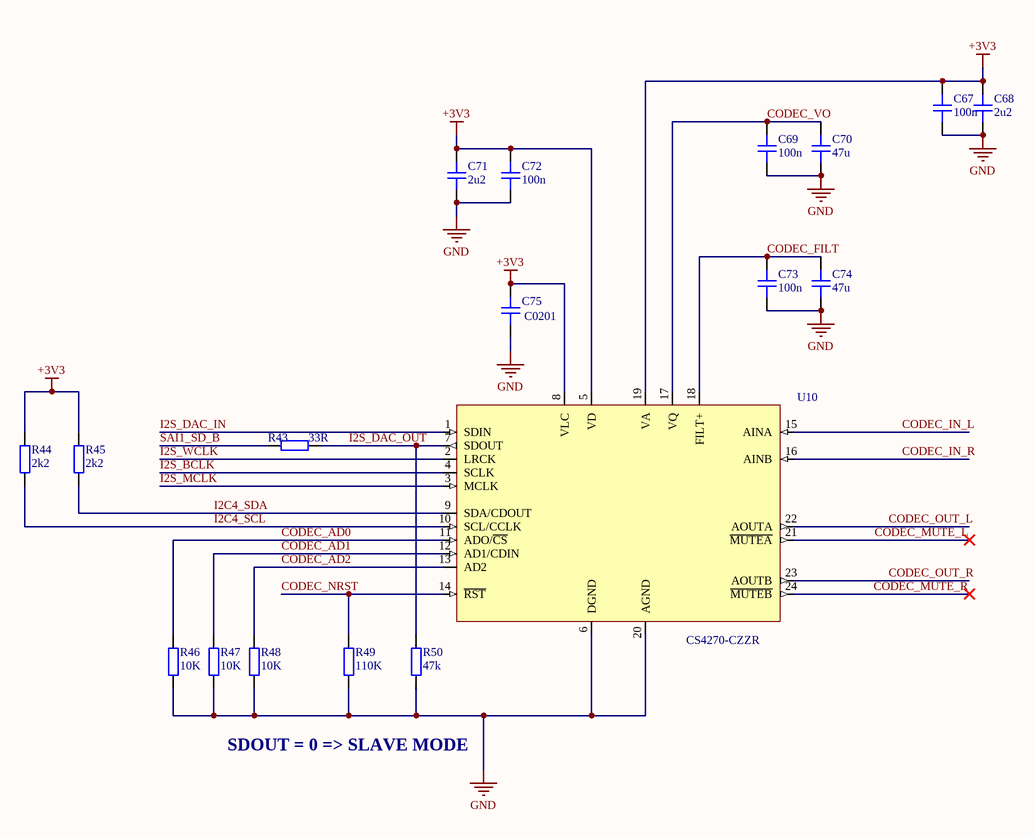
[diagram p5: 6_CODEC.SchDoc]

### Parts
C67  100n  [CAP_0201]
C68  2u2  [CAP_0201]
C69  100n  [CAP_0201]
C70  47u  [CAP_0201]
C71  2u2  [CAP_0201]
C72  100n  [CAP_0201]
C73  100n  [CAP_0201]
C74  47u  [CAP_0201]
C75  C0201  [CAP_0201]
R43  33R  [RES_0402]
R44  2k2  [RES_0402]
R45  2k2  [RES_0402]
R46  10K  [RES_0402]
R47  10K  [RES_0402]
R48  10K  [RES_0402]
R49  110K  [RES_0402]
R50  47k  [RES_0402]
U10  CS4270-CZZR  [TSSOP-24]

### Nets
+3V3: C67.2 C68.2 C71.2 C72.2 C75.2 R44.1 R45.1 U10.5(VD) U10.8(VLC) U10.19(VA)
GND: C67.1 C68.1 C69.1 C70.1 C71.1 C72.1 C73.1 C74.1 C75.1 R46.1 R47.1 R48.1 R49.1 R50.1 U10.6(DGND) U10.20(AGND)
CODEC_AD0: R46.2 U10.11(ADO/~{CS})
CODEC_AD1: R47.2 U10.12(AD1/CDIN)
CODEC_AD2: R48.2 U10.13(AD2)
CODEC_FILT: C73.2 C74.2 U10.18(FILT+)
CODEC_IN_L: U10.15(AINA)
CODEC_IN_R: U10.16(AINB)
CODEC_MUTE_L: U10.21(~{MUTEA})
CODEC_MUTE_R: U10.24(~{MUTEB})
CODEC_NRST: R49.2 U10.14(~{RST})
CODEC_OUT_L: U10.22(AOUTA)
CODEC_OUT_R: U10.23(AOUTB)
CODEC_VO: C69.2 C70.2 U10.17(VQ)
I2C4_SCL: R44.2 U10.10(SCL/CCLK)
I2C4_SDA: R45.2 U10.9(SDA/CDOUT)
I2S_BCLK: U10.4(SCLK)
I2S_DAC_IN: U10.1(SDIN)
I2S_DAC_OUT: R43.1 R50.2 U10.7(SDOUT)
I2S_MCLK: U10.3(MCLK)
I2S_WCLK: U10.2(LRCK)
SAI1_SD_B: R43.2

### Notes on the sheet
- SDOUT = 0 => SLAVE MODE

### Library data of the parts
C67-C75 = CAP_0201: Capacitor SMD 0201; Manufacturer: *; Manufacturer Part Number: *; Distributor Link: *; LCSC: *; Rating: *; Dielectric: *
R43-R50 = RES_0402: Resistor SMD 0402; Manufacturer: *; Manufacturer Part Number: *; Distributor Link: *; LCSC: *
U10 = CS4270-CZZR: 24-Bit 192kHz Stereo Audio Codec TSSOP-24; Manufacturer: Cirrus Logic; Manufacturer Part Number: CS4270-CZZR

## Sheet 7_Analogue.SchDoc
size 420 x 297 mm; SheetNumber: 7; SheetTotal: 7
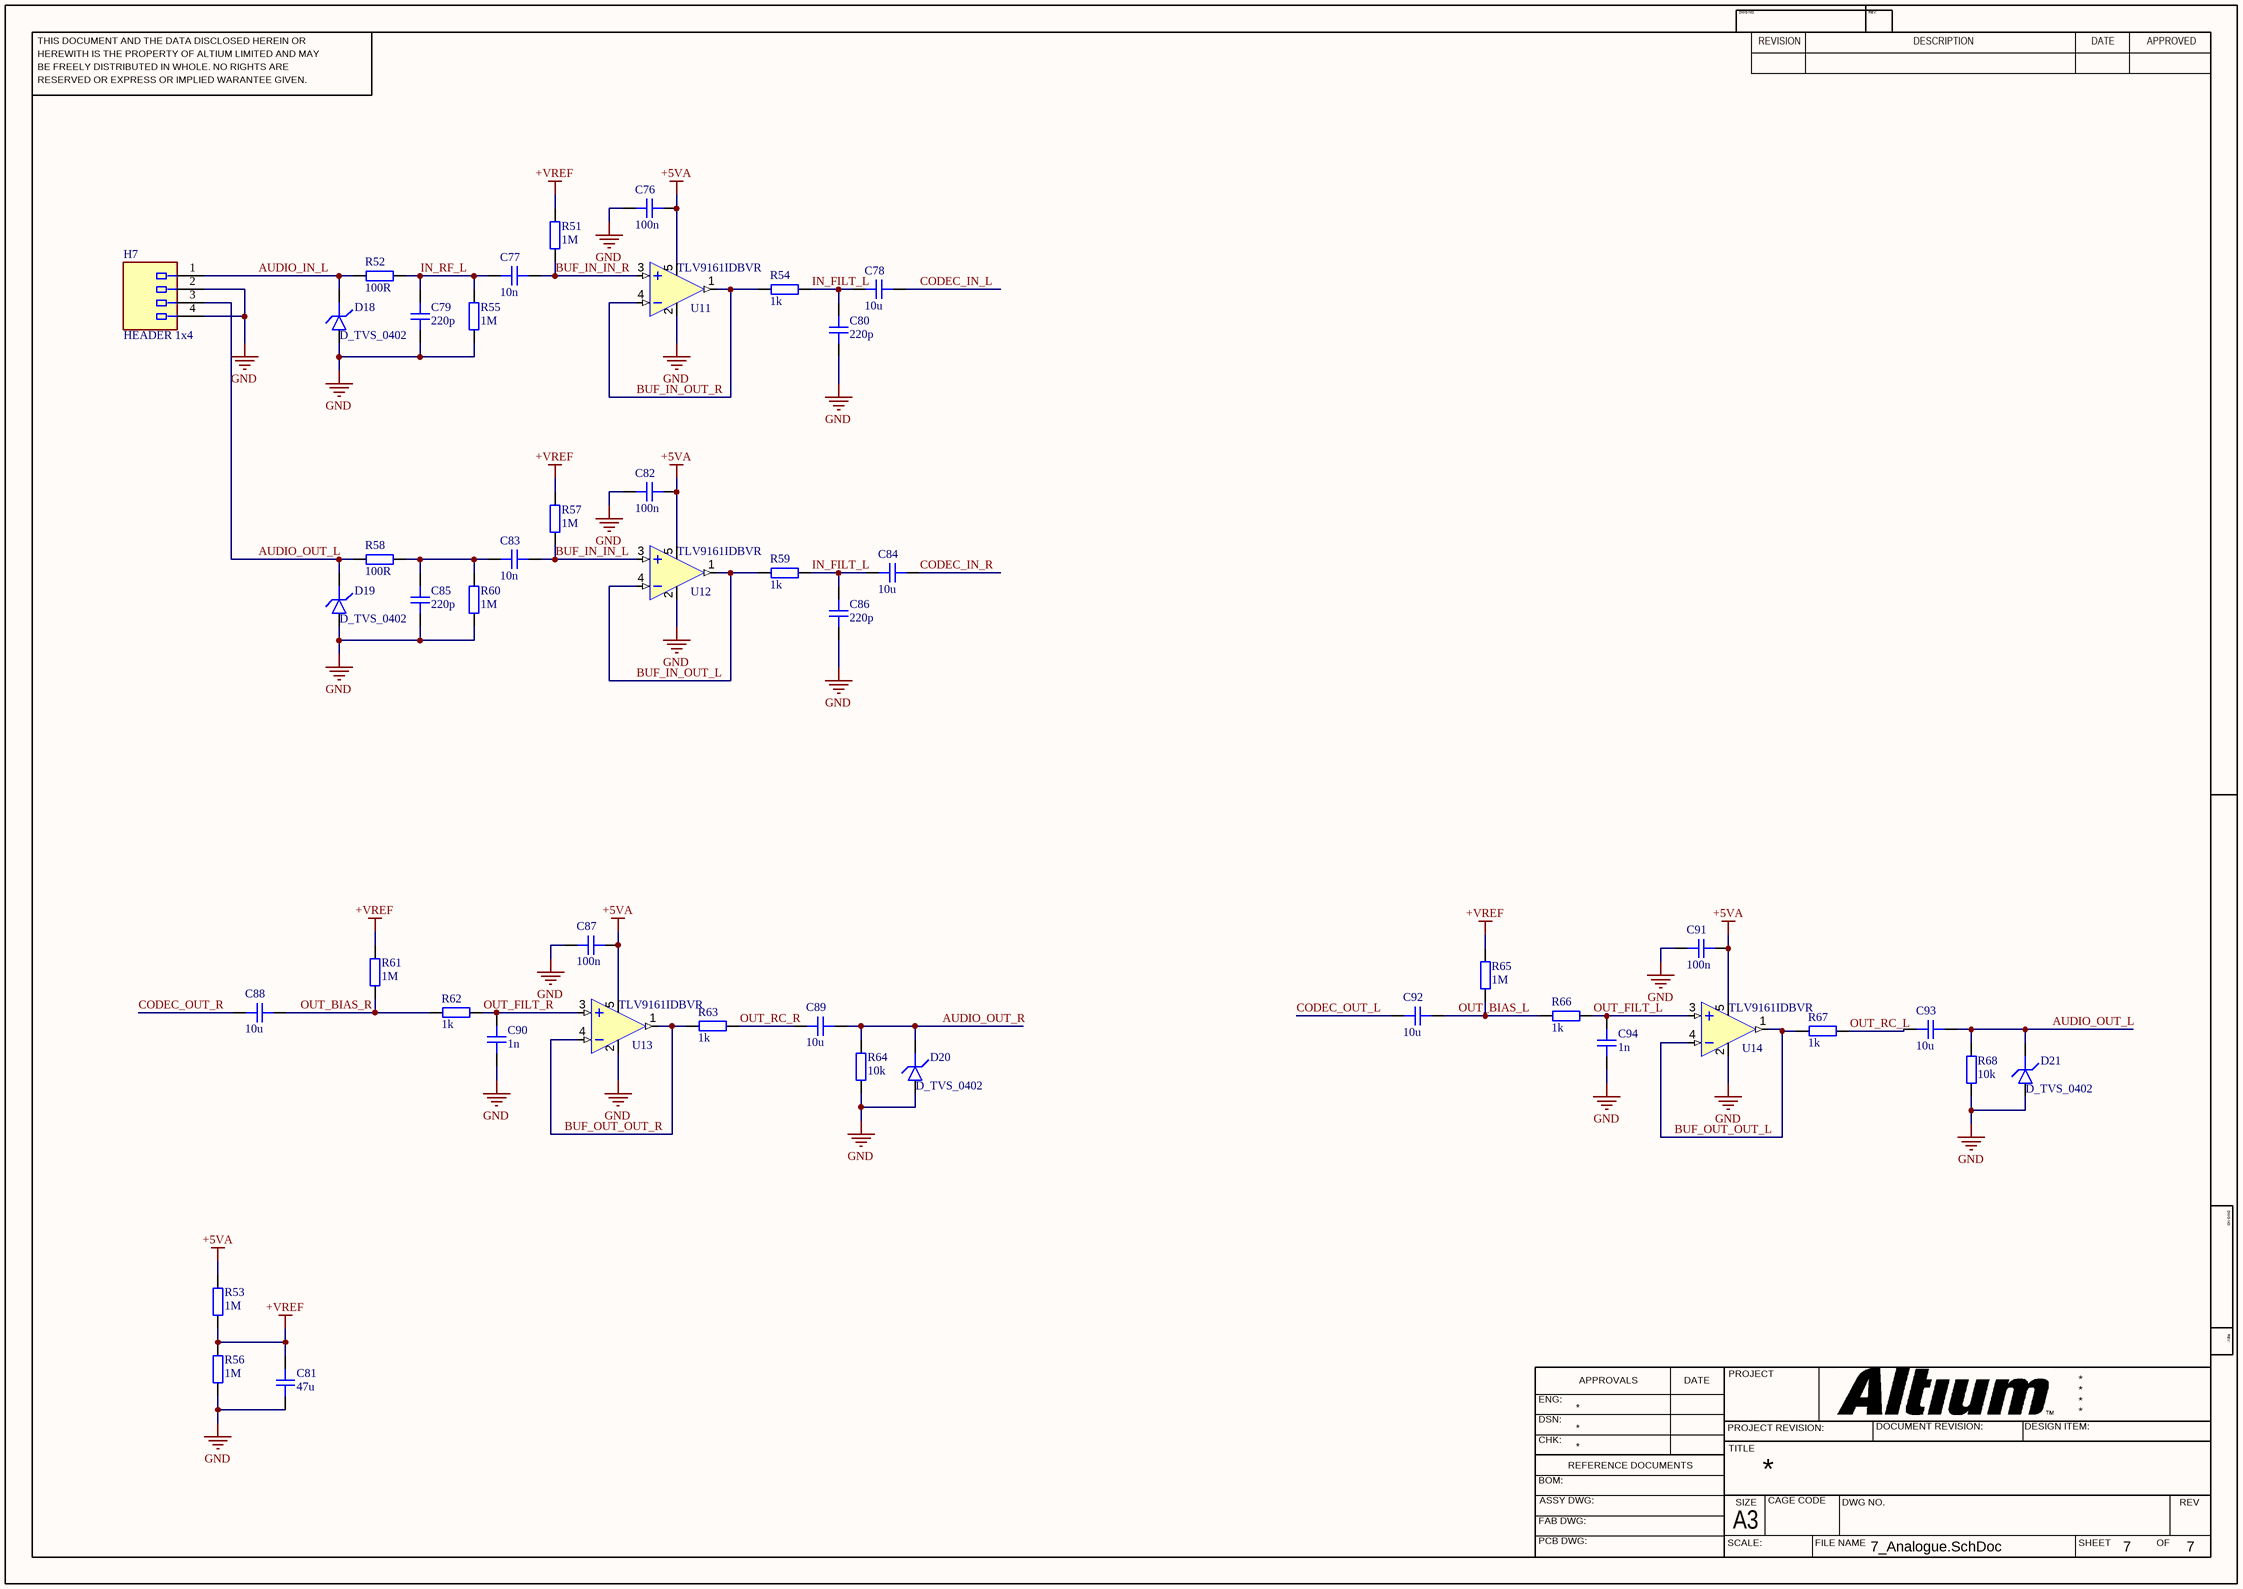
[diagram p6: 7_Analogue.SchDoc]

### Parts
C76  100n  [CAP_0402]
C77  10n  [CAP_0402]
C78  10u  [CAP_0402]
C79  220p  [CAP_0402]
C80  220p  [CAP_0402]
C81  47u  [CAP_0402]
C82  100n  [CAP_0402]
C83  10n  [CAP_0402]
C84  10u  [CAP_0402]
C85  220p  [CAP_0402]
C86  220p  [CAP_0402]
C87  100n  [CAP_0402]
C88  10u  [CAP_0402]
C89  10u  [CAP_0402]
C90  1n  [CAP_0402]
C91  100n  [CAP_0402]
C92  10u  [CAP_0402]
C93  10u  [CAP_0402]
C94  1n  [CAP_0402]
D18  D_TVS_0402  [D_0402]
D19  D_TVS_0402  [D_0402]
D20  D_TVS_0402  [D_0402]
D21  D_TVS_0402  [D_0402]
H7  HEADER 1x4  [053048-0410]
R51  1M  [RES_0402]
R52  100R  [RES_0402]
R53  1M  [RES_0402]
R54  1k  [RES_0402]
R55  1M  [RES_0402]
R56  1M  [RES_0402]
R57  1M  [RES_0402]
R58  100R  [RES_0402]
R59  1k  [RES_0402]
R60  1M  [RES_0402]
R61  1M  [RES_0402]
R62  1k  [RES_0402]
R63  1k  [RES_0402]
R64  10k  [RES_0402]
R65  1M  [RES_0402]
R66  1k  [RES_0402]
R67  1k  [RES_0402]
R68  10k  [RES_0402]
U11  TLV9161IDBVR  [SOT-23-5]
U12  TLV9161IDBVR  [SOT-23-5]
U13  TLV9161IDBVR  [SOT-23-5]
U14  TLV9161IDBVR  [SOT-23-5]

### Nets
+5VA: C76.1 C82.1 C87.1 C91.1 R53.2 U11.5(V+) U12.5(V+) U13.5(V+) U14.5(V+)
+VREF: C81.1 R51.2 R53.1 R56.2 R57.2 R61.2 R65.2
GND: C76.2 C79.1 C80.2 C81.2 C82.2 C85.1 C86.2 C87.2 C90.2 C91.2 C94.2 D18.A D19.A D20.A D21.A H7.2 H7.4 R55.1 R56.1 R60.1 R64.2 R68.2 U11.2(V-) U12.2(V-) U13.2(V-) U14.2(V-)
AUDIO_IN_L: D18.K H7.1 R52.1
AUDIO_OUT_L: C93.1 D19.K D21.K H7.3 R58.1 R68.1
AUDIO_OUT_R: C89.1 D20.K R64.1
BUF_IN_IN_L: C83.1 R57.1 U12.3(IN+)
BUF_IN_IN_R: C77.1 R51.1 U11.3(IN+)
BUF_IN_OUT_L: R59.2 U12.1(OUT) U12.4(IN-)
BUF_IN_OUT_R: R54.2 U11.1(OUT) U11.4(IN-)
BUF_OUT_OUT_L: R67.2 U14.1(OUT) U14.4(IN-)
BUF_OUT_OUT_R: R63.2 U13.1(OUT) U13.4(IN-)
CODEC_IN_L: C78.1
CODEC_IN_R: C84.1
CODEC_OUT_L: C92.2
CODEC_OUT_R: C88.2
IN_FILT_L: C78.2 C80.1 C84.2 C86.1 R54.1 R59.1
IN_RF_L: C77.2 C79.2 R52.2 R55.2
OUT_BIAS_L: C92.1 R65.1 R66.2
OUT_BIAS_R: C88.1 R61.1 R62.2
OUT_FILT_L: C94.1 R66.1 U14.3(IN+)
OUT_FILT_R: C90.1 R62.1 U13.3(IN+)
OUT_RC_L: C93.2 R67.1
OUT_RC_R: C89.2 R63.1
NetC83_2: C83.2 C85.2 R58.2 R60.2

### Notes on the sheet
- THIS DOCUMENT AND THE DATA DISCLOSED HEREIN OR
- HEREWITH IS THE PROPERTY OF ALTIUM LIMITED AND MAY
- DWG NO:
- REVISION
- REV:
- DESCRIPTION
- DATE
- APPROVED
- BE FREELY DISTRIBUTED IN WHOLE. NO RIGHTS ARE
- RESERVED OR EXPRESS OR IMPLIED WARANTEE GIVEN.
- ENG:
- APPROVALS
- PROJECT
- DSN:
- CHK:
- REFERENCE DOCUMENTS
- PROJECT REVISION:
- TITLE
- DOCUMENT REVISION:
- DESIGN ITEM:
- BOM:
- FAB DWG:
- PCB DWG:
- ASSY DWG:
- SCALE:
- A3
- SIZE
- CAGE CODE
- FILE NAME
- DWG NO.
- SHEET
- OF
- REV

### Library data of the parts
C76-C94 = CAP_0402: Capacitor SMD 0402; Manufacturer: *; Manufacturer Part Number: *; Distributor Link: *; LCSC: *; Rating: *; Dielectric: *
D18-D21 = D_TVS_0402: Diode TVS / ESD 0402
H7 = 053048-0410
R51-R68 = RES_0402: Resistor SMD 0402; Manufacturer: *; Manufacturer Part Number: *; Distributor Link: *; LCSC: *
U11-U14 = TLV9161IDBVR: TLV916x 16-V, 11-MHz, Rail-to-Rail Input/Output, Low Offset Voltage, Low Noise Op Amp SOT-23-5; Manufacturer: Texas Instruments; Manufacturer Part Number: TLV9161IDBVR

## Nets that join several sheets
+1V8: 1_Power (C6.2 R5.2 U2.5), 4_USB-HS (C49.2 U7.21)
+3V3: 1_Power (5 pins), 2_MCU (32 pins), 3_Memory (28 pins), 4_USB-HS (8 pins), 5_Periperals (9 pins), 6_CODEC (10 pins)
+5VA: 1_Power (5 pins), 7_Analogue (9 pins)
+VUSB_FILT: 1_Power (D1.2), 4_USB-HS (C51.2 R33.2), 5_Periperals (C56.1 L3.2)
GND: 1_Power (24 pins), 2_MCU (42 pins), 3_Memory (25 pins), 4_USB-HS (9 pins), 5_Periperals (32 pins), 6_CODEC (16 pins), 7_Analogue (26 pins)
ADC_IN14: 2_MCU (U4.36), 5_Periperals (C66.1 R72.1)
ADC_IN16: 2_MCU (U4.34), 5_Periperals (C61.1 R70.1)
ADC_IN17: 2_MCU (U4.35), 5_Periperals (C62.1 R71.1)
ADC_IN18: 2_MCU (U4.40), 5_Periperals (C60.1 R69.1)
CODEC_IN_L: 6_CODEC (U10.15), 7_Analogue (C78.1)
CODEC_IN_R: 6_CODEC (U10.16), 7_Analogue (C84.1)
CODEC_NRST: 2_MCU (U4.7), 6_CODEC (R49.2 U10.14)
CODEC_OUT_L: 6_CODEC (U10.22), 7_Analogue (C92.2)
CODEC_OUT_R: 6_CODEC (U10.23), 7_Analogue (C88.2)
I2C4_SCL: 2_MCU (U4.81), 6_CODEC (R44.2 U10.10)
I2C4_SDA: 2_MCU (U4.82), 6_CODEC (R45.2 U10.9)
I2S_BCLK: 2_MCU (R14.1), 6_CODEC (U10.4)
I2S_DAC_IN: 2_MCU (R15.1), 6_CODEC (U10.1)
I2S_MCLK: 2_MCU (R10.1), 6_CODEC (U10.3)
I2S_WCLK: 2_MCU (R12.1), 6_CODEC (U10.2)
QSPI_CLK: 2_MCU (R23.1), 3_Memory (U6.6)
QSPI_IO0: 2_MCU (U4.21), 3_Memory (U6.5)
QSPI_IO1: 2_MCU (U4.20), 3_Memory (U6.2)
QSPI_IO2: 2_MCU (U4.19), 3_Memory (U6.3)
QSPI_IO3: 2_MCU (U4.18), 3_Memory (U6.7)
QSPI_NCS: 2_MCU (U4.91), 3_Memory (R32.1 U6.1)
RAM_A0: 2_MCU (U4.10), 3_Memory (U5.H7)
RAM_A1: 2_MCU (U4.11), 3_Memory (U5.H8)
RAM_A2: 2_MCU (U4.12), 3_Memory (U5.J8)
RAM_A3: 2_MCU (U4.13), 3_Memory (U5.J7)
RAM_A4: 2_MCU (U4.14), 3_Memory (U5.J3)
RAM_A5: 2_MCU (U4.15), 3_Memory (U5.J2)
RAM_A6: 2_MCU (U4.50), 3_Memory (U5.H3)
RAM_A7: 2_MCU (U4.53), 3_Memory (U5.H2)
RAM_A8: 2_MCU (U4.54), 3_Memory (U5.H1)
RAM_A9: 2_MCU (U4.55), 3_Memory (U5.G3)
RAM_A10: 2_MCU (U4.56), 3_Memory (U5.H9)
RAM_A11: 2_MCU (U4.57), 3_Memory (U5.G2)
RAM_BA0: 2_MCU (U4.89), 3_Memory (U5.G7)
RAM_BA1: 2_MCU (U4.90), 3_Memory (U5.G8)
RAM_CKE: 2_MCU (U4.45), 3_Memory (U5.F3)
RAM_CLK: 2_MCU (R21.2), 3_Memory (U5.F2)
RAM_D0: 2_MCU (U4.85), 3_Memory (U5.A8)
RAM_D1: 2_MCU (U4.86), 3_Memory (U5.B9)
RAM_D2: 2_MCU (U4.114), 3_Memory (U5.B8)
RAM_D3: 2_MCU (U4.115), 3_Memory (U5.C9)
RAM_D4: 2_MCU (U4.58), 3_Memory (U5.C8)
RAM_D5: 2_MCU (U4.59), 3_Memory (U5.D9)
RAM_D6: 2_MCU (U4.60), 3_Memory (U5.D8)
RAM_D7: 2_MCU (U4.63), 3_Memory (U5.E9)
RAM_D8: 2_MCU (U4.64), 3_Memory (U5.E1)
RAM_D9: 2_MCU (U4.65), 3_Memory (U5.D2)
RAM_D10: 2_MCU (U4.66), 3_Memory (U5.D1)
RAM_D11: 2_MCU (U4.67), 3_Memory (U5.C2)
RAM_D12: 2_MCU (U4.68), 3_Memory (U5.C1)
RAM_D13: 2_MCU (U4.77), 3_Memory (U5.B2)
RAM_D14: 2_MCU (U4.78), 3_Memory (U5.B1)
RAM_D15: 2_MCU (U4.79), 3_Memory (U5.A2)
RAM_DMH: 2_MCU (U4.142), 3_Memory (U5.F1)
RAM_DML: 2_MCU (U4.141), 3_Memory (U5.E8)
RAM_NCAS: 2_MCU (U4.132), 3_Memory (U5.F7)
RAM_NCS: 2_MCU (U4.44), 3_Memory (U5.G9)
RAM_NRAS: 2_MCU (U4.49), 3_Memory (U5.F8)
RAM_NWE: 2_MCU (U4.43), 3_Memory (U5.F9)
SAI1_SD_B: 2_MCU (U4.2), 6_CODEC (R43.2)
SD_CLK: 2_MCU (U4.122), 3_Memory (J2.5)
SD_CMD: 2_MCU (U4.123), 3_Memory (J2.3 R28.1)
SD_D0: 2_MCU (U4.124), 3_Memory (J2.7 R30.1)
SD_D1: 2_MCU (U4.125), 3_Memory (J2.8 R29.1)
SD_D2: 2_MCU (U4.126), 3_Memory (J2.1 R26.1)
SD_D3: 2_MCU (U4.127), 3_Memory (J2.2 R27.1)
SD_DET: 2_MCU (U4.128), 3_Memory (J2.9 R31.1)
UART_DE: 2_MCU (U4.110), 5_Periperals (U9.3)
UART_NRE: 2_MCU (U4.113), 5_Periperals (U9.2)
UART_RX: 2_MCU (U4.112), 5_Periperals (U9.1)
UART_TX: 2_MCU (U4.111), 5_Periperals (U9.4)
ULPI_CLK: 2_MCU (U4.41), 4_USB-HS (U7.12)
ULPI_D0: 2_MCU (U4.37), 4_USB-HS (U7.16)
ULPI_D1: 2_MCU (U4.46), 4_USB-HS (U7.15)
ULPI_D2: 2_MCU (U4.47), 4_USB-HS (U7.14)
ULPI_D3: 2_MCU (U4.69), 4_USB-HS (U7.13)
ULPI_D4: 2_MCU (U4.70), 4_USB-HS (U7.11)
ULPI_D5: 2_MCU (U4.73), 4_USB-HS (U7.10)
ULPI_D6: 2_MCU (U4.74), 4_USB-HS (U7.9)
ULPI_D7: 2_MCU (U4.135), 4_USB-HS (U7.8)
ULPI_DIR: 2_MCU (U4.28), 4_USB-HS (U7.19)
ULPI_NXT: 2_MCU (U4.29), 4_USB-HS (U7.18)
ULPI_STP: 2_MCU (U4.26), 4_USB-HS (U7.20)
USB_FS_D_N: 2_MCU (U4.103), 5_Periperals (U8.6)
USB_FS_D_P: 2_MCU (U4.104), 5_Periperals (U8.7)
USB_HS_D_N: 4_USB-HS (U7.5), 5_Periperals (U8.4)
USB_HS_D_P: 4_USB-HS (U7.6), 5_Periperals (U8.5)
USB_NRST: 2_MCU (U4.129), 4_USB-HS (R34.1 U7.22)
USB_SW: 2_MCU (U4.102), 5_Periperals (R39.2 U8.10)